# Altium schematic sheet Sheet1.SchDoc
size A
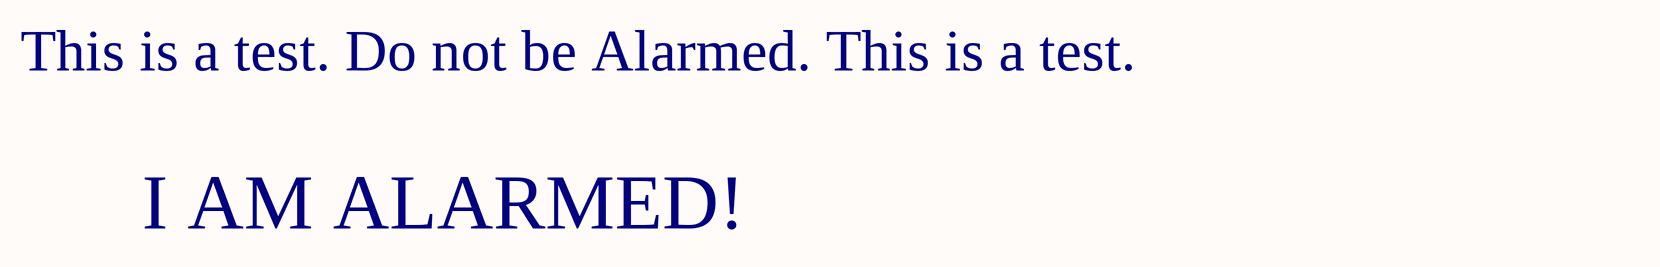
[diagram p0: Sheet1.SchDoc]

## Notes on the sheet
- This is a test. Do not be Alarmed. This is a test.
- I AM ALARMED!